# Altium schematic sheet analogSignals.SchDoc
size A4
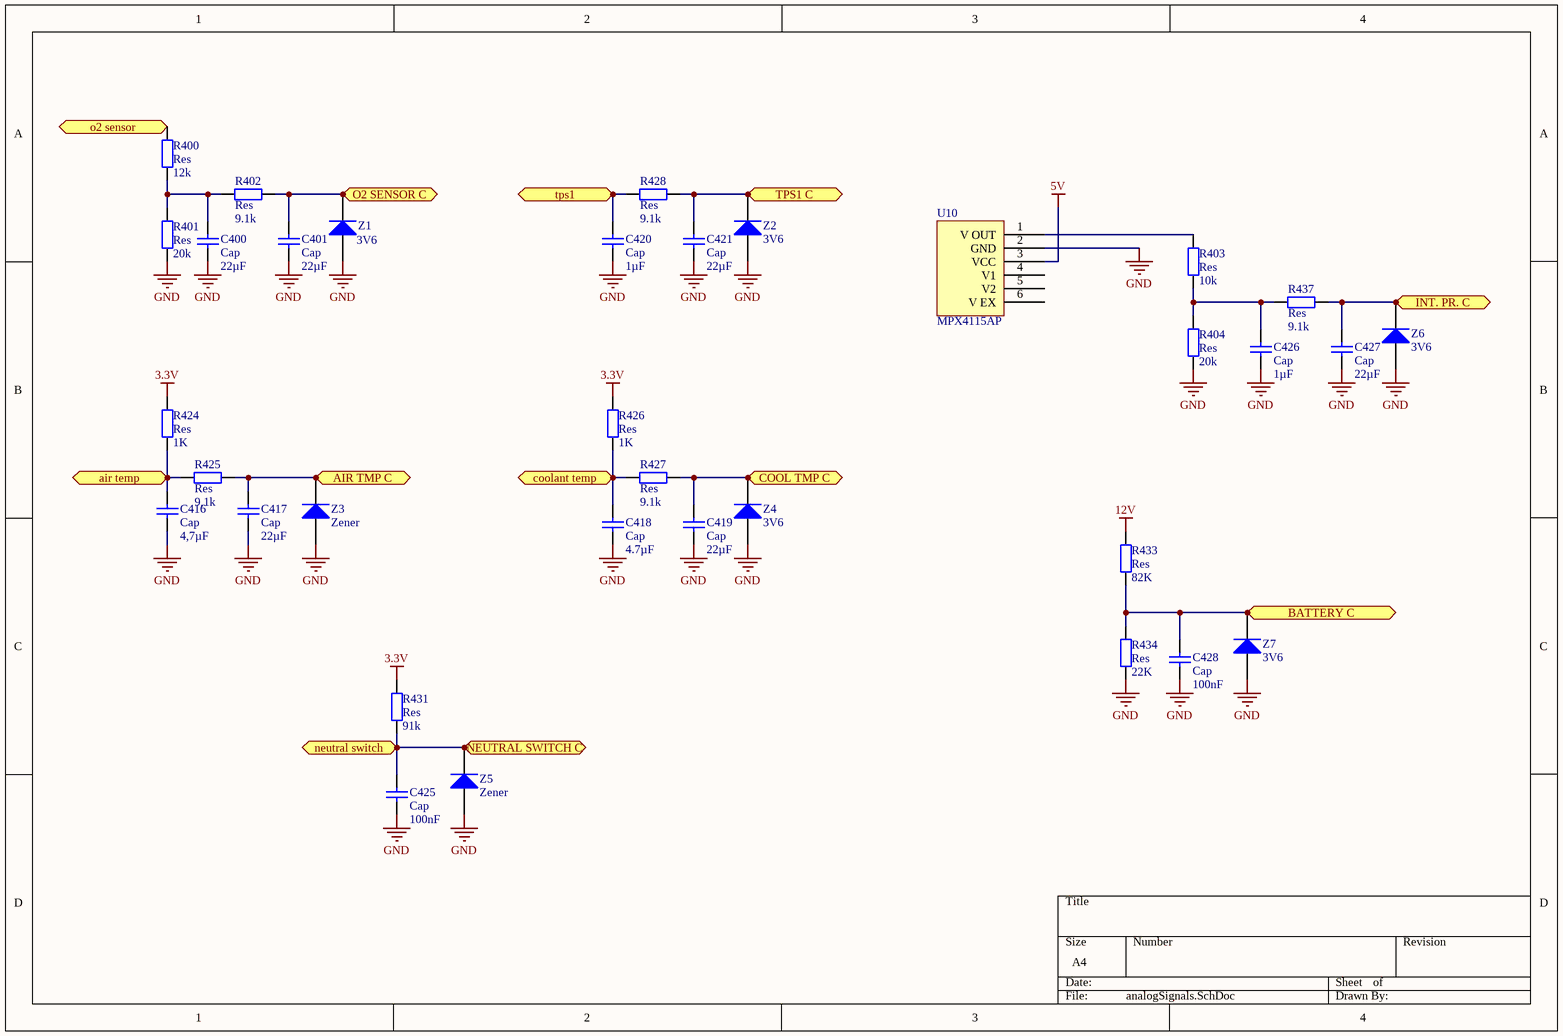
[diagram p0: analogSignals.SchDoc]

## Parts
C400  Cap  value 22µF  [1206 footprint]
C401  Cap  value 22µF  [1206 footprint]
C416  Cap  value 4,7µF  [1206 footprint]
C417  Cap  value 22µF  [1206 footprint]
C418  Cap  value 4.7µF  [1206 footprint]
C419  Cap  value 22µF  [1206 footprint]
C420  Cap  value 1µF  [1206 footprint]
C421  Cap  value 22µF  [1206 footprint]
C425  Cap  value 100nF  [1206 footprint]
C426  Cap  value 1µF  [1206 footprint]
C427  Cap  value 22µF  [1206 footprint]
C428  Cap  value 100nF  [1206 footprint]
R400  Res  value 12k  [1206 footprint]
R401  Res  value 20k  [1206 footprint]
R402  Res  value 9.1k  [1206 footprint]
R403  Res  value 10k  [1206 footprint]
R404  Res  value 20k  [1206 footprint]
R424  Res  value 1K  [1206 footprint]
R425  Res  value 9,1k  [1206 footprint]
R426  Res  value 1K  [1206 footprint]
R427  Res  value 9.1k  [1206 footprint]
R428  Res  value 9.1k  [1206 footprint]
R431  Res  value 91k  [1206 footprint]
R433  Res  value 82K  [1206 footprint]
R434  Res  value 22K  [1206 footprint]
R437  Res  value 9.1k  [1206 footprint]
U10  MPX4115AP  [MPX4115AP]
Z1  3V6  [SOD-80]
Z2  3V6  [SOD-80]
Z3  Zener  [SOD-80]
Z4  3V6  [SOD-80]
Z5  Zener  [SOD-80]
Z6  3V6  [SOD-80]
Z7  3V6  [SOD-80]

## Ports
air temp (bidir), AIR TMP C (bidir), BATTERY C (bidir), COOL TMP C (bidir), coolant temp (bidir), INT. PR. C (bidir), neutral switch (bidir), NEUTRAL SWITCH C (bidir), o2 sensor (bidir), O2 SENSOR C (bidir), tps1 (bidir), TPS1 C (bidir)

## Nets
3.3V: R424.2 R426.2 R431.2
5V: U10.3(VCC)
12V: R433.2
GND: C400.1 C401.1 C416.1 C417.1 C418.1 C419.1 C420.1 C421.1 C425.1 C426.1 C427.1 C428.1 R401.1 R404.1 R434.1 U10.2(GND) Z1.1(A) Z2.1(A) Z3.1(A) Z4.1(A) Z5.1(A) Z6.1(A) Z7.1(A)
air temp: C416.2 R424.1 R425.1 ; port air temp
AIR TMP C: C417.2 R425.2 Z3.2(K) ; port AIR TMP C
BATTERY C: C428.2 R433.1 R434.2 Z7.2(K) ; port BATTERY C
COOL TMP C: C419.2 R427.2 Z4.2(K) ; port COOL TMP C
coolant temp: C418.2 R426.1 R427.1 ; port coolant temp
INT. PR. C: C427.2 R437.2 Z6.2(K) ; port INT. PR. C
neutral switch: C425.2 R431.1 Z5.2(K) ; port neutral switch, port NEUTRAL SWITCH C
o2 sensor: R400.2 ; port o2 sensor
O2 SENSOR C: C401.2 R402.2 Z1.2(K) ; port O2 SENSOR C
tps1: C420.2 R428.1 ; port tps1
TPS1 C: C421.2 R428.2 Z2.2(K) ; port TPS1 C
NetC400_2: C400.2 R400.1 R401.2 R402.1
NetC426_2: C426.2 R403.1 R404.2 R437.1
NetR403_2: R403.2 U10.1(V_OUT)

Not connected (* = marked no-connect by the designer): U10 4(V1) 5(V2) 6(V_EX)

## Library data of the parts
Z1-Z7 = TZM